# EAGLE design game_kit (EAGLE 5.10)
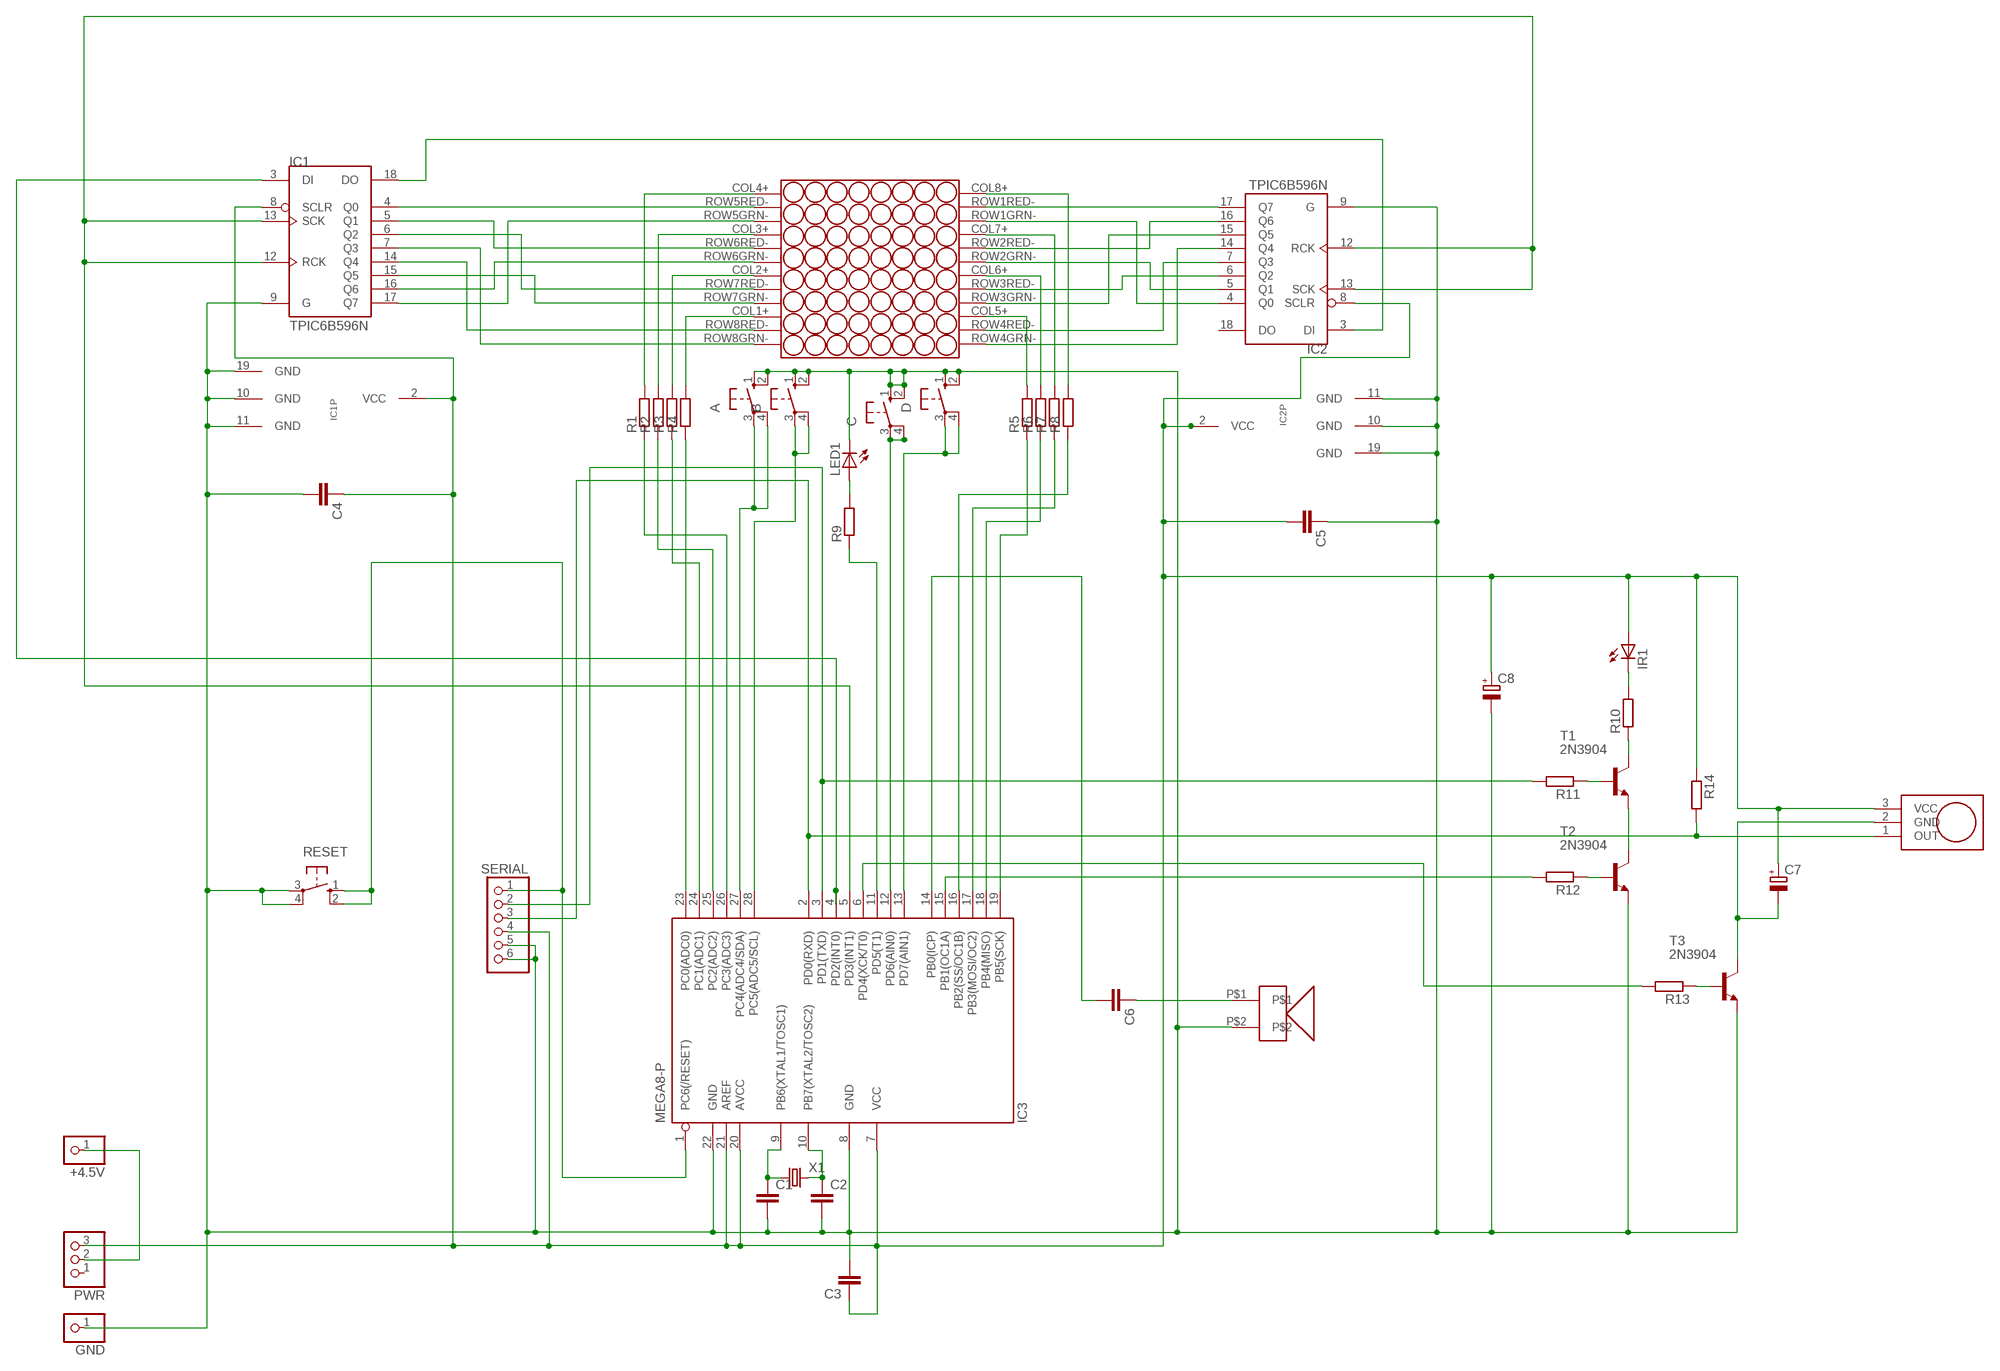
[diagram p0: schematic, sheet 1]

## Parts
+4.5V  PINHD-1X1  [1X01]
A  10-XX  [B3F-10XX]
B  10-XX  [B3F-10XX]
C  10-XX  [B3F-10XX]
C1  C2.5/2  [C2.5-2]
C2  C2.5/2  [C2.5-2]
C3  C2.5/2  [C2.5-2]
C4  C2.5/2  [C2.5-2]
C5  C2.5/2  [C2.5-2]
C6  C2.5/2  [C2.5-2]
C7  CPOL-EUE2.5-5  [E2,5-5]
C8  CPOL-EUE2.5-5  [E2,5-5]
D  10-XX  [B3F-10XX]
GND  PINHD-1X1  [1X01]
IC1  TPIC6B596N  [DIL20]
IC2  TPIC6B596N  [DIL20]
IC3  MEGA8-P  [DIL28-3]
IR1  LED5MM  [LED5MM]
LED1  LED3MM  [LED3MM]
PWR  PINHD-1X3  [1X03]
R1  R-EU_0207/10  [0207/10]
R2  R-EU_0207/10  [0207/10]
R3  R-EU_0207/10  [0207/10]
R4  R-EU_0207/10  [0207/10]
R5  R-EU_0207/10  [0207/10]
R6  R-EU_0207/10  [0207/10]
R7  R-EU_0207/10  [0207/10]
R8  R-EU_0207/10  [0207/10]
R9  R-EU_0207/10  [0207/10]
R10  R-EU_0207/2V  [0207/2V]
R11  R-EU_0207/2V  [0207/2V]
R12  R-EU_0207/2V  [0207/2V]
R13  R-EU_0207/2V  [0207/2V]
R14  R-EU_0207/10  [0207/10]
RESET  10-XX  [B3F-10XX]
SERIAL  PINHD-1X6  [1X06]
T1  2N3904  [TO92]
T2  2N3904  [TO92]
T3  2N3904  [TO92]
U$1  8X8  [SURE8X8]
U$2  THRUHOLEBEEPER  [THRUHOLEBEEPER]
U$3  TSOP4838  [TSOP4838]
X1  CRYSTALHC49U-V  [HC49U-V]

## Nets
GND: A.1(S) A.2(S1) B.1(S) B.2(S1) C1.2 C2.2 C3.2 C4.2 C5.1 C8.- C.1(S) C.2(S1) D.1(S) D.2(S1) GND.1 IC1.9(G) IC1.10(GND) IC1.11(GND) IC1.19(GND) IC2.9(G) IC2.10(GND) IC2.11(GND) IC2.19(GND) IC3.8(GND) IC3.22(GND) LED1.K(C) RESET.3(P) RESET.4(P1) SERIAL.5 SERIAL.6 T2.3(E) T3.3(E) U$2.P$2
N$1: IC1.4(Q0) U$1.ROW5RED-(RED5_CA)
N$2: IC1.17(Q7) U$1.ROW5GRN-(GRN5_CA)
N$3: IC1.5(Q1) U$1.ROW6RED-(RED6_CA)
N$4: IC1.16(Q6) U$1.ROW6GRN-(GRN6_CA)
N$5: IC1.6(Q2) U$1.ROW7RED-(RED7_CA)
N$6: IC1.15(Q5) U$1.ROW7GRN-(GRN7_CA)
N$7: IC1.7(Q3) U$1.ROW8GRN-(GRN8_CA)
N$8: IC1.14(Q4) U$1.ROW8RED-(RED8_CA)
N$9: IC2.17(Q7) U$1.ROW1RED-(RED1_CA)
N$10: IC2.4(Q0) U$1.ROW1GRN-(GRN1_CA)
N$11: IC2.16(Q6) U$1.ROW2RED-(RED2_CA)
N$12: IC2.5(Q1) U$1.ROW2GRN-(GRN2_CA)
N$13: IC2.6(Q2) U$1.ROW3RED-(RED3_CA)
N$14: IC2.15(Q5) U$1.ROW3GRN-(GRN3_CA)
N$15: IC2.7(Q3) U$1.ROW4RED-(RED4_CA)
N$16: IC2.14(Q4) U$1.ROW4GRN-(GRN4_CA)
N$17: R1.2 U$1.COL4+(COL4_AN)
N$18: R2.2 U$1.COL3+(COL3_AN)
N$19: R3.2 U$1.COL2+(COL2_AN)
N$20: R4.2 U$1.COL1+(COL1_AN)
N$21: R5.2 U$1.COL5+(COL5_AN)
N$22: R6.2 U$1.COL6+(COL6_AN)
N$23: R7.2 U$1.COL7+(COL7_AN)
N$24: R8.2 U$1.COL8+(COL8_AN)
N$25: IC3.23(PC0(ADC0)) R4.1
N$26: IC3.24(PC1(ADC1)) R3.1
N$27: IC3.25(PC2(ADC2)) R2.1
N$28: IC3.26(PC3(ADC3)) R1.1
N$29: IC3.16(PB2(SS/OC1B)) R8.1
N$30: IC3.18(PB4(MISO)) R6.1
N$31: IC3.19(PB5(SCK)) R5.1
N$32: +4.5V.1 PWR.2
N$33: C2.1 IC3.10(PB7(XTAL2/TOSC2)) X1.2
N$34: C1.1 IC3.9(PB6(XTAL1/TOSC1)) X1.1
N$35: IC3.3(PD1(TXD)) R11.2 SERIAL.2
N$36: IC3.1(PC6(/RESET)) RESET.1(S) RESET.2(S1) SERIAL.1
N$37: IR1.K(C) R10.2
N$38: IC3.2(PD0(RXD)) R14.2 SERIAL.3 U$3.1(OUT)
N$39: R10.1 T1.1(C)
N$40: C6.1 U$2.P$1
N$41: C6.2 IC3.14(PB0(ICP))
N$42: A.3(P) A.4(P1) IC3.27(PC4(ADC4/SDA))
N$43: B.3(P) B.4(P1) IC3.28(PC5(ADC5/SCL))
N$44: LED1.A R9.2
N$45: C.3(P) C.4(P1) IC3.12(PD6(AIN0))
N$46: D.3(P) D.4(P1) IC3.13(PD7(AIN1))
N$47: IC3.17(PB3(MOSI/OC2)) R7.1
N$48: IC3.11(PD5(T1)) R9.1
N$49: T1.3(E) T2.1(C)
N$50: R11.1 T1.2(B)
N$51: R12.1 T2.2(B)
N$52: IC1.12(RCK) IC1.13(SCK) IC2.12(RCK) IC2.13(SCK) IC3.5(PD3(INT1))
N$53: IC1.18(DO) IC2.3(DI)
N$54: IC1.3(DI) IC3.4(PD2(INT0))
N$55: IC3.15(PB1(OC1A)) R12.2
N$56: R13.1 T3.2(B)
N$57: C7.- T3.1(C) U$3.2(GND)
N$58: IC3.6(PD4(XCK/T0)) R13.2
VCC: C3.1 C4.1 C5.2 C7.+ C8.+ IC1.2(VCC) IC1.8(SCLR) IC2.2(VCC) IC2.8(SCLR) IC3.7(VCC) IC3.20(AVCC) IC3.21(AREF) IR1.A PWR.3 R14.1 SERIAL.4 U$3.3(VCC)
Unconnected: IC2.18(DO) PWR.1

## Library data of the parts
+4.5V GND = pinhead:PINHD-1X1: PIN HEADER
A B C D RESET = switch-omron:10-XX: OMRON SWITCH
C1-C6 = capacitor-wima:C: CAPACITOR naming: grid - package width
C7 C8 = resistor:CPOL-EU: POLARIZED CAPACITOR, European symbol
IC1 IC2 = tpic:TPIC6B596
IC3 = atmel:MEGA8-P: MICROCONTROLLER 8 Kbytes FLASH, 1 kbytes SRAM, 512 bytes EEPROM, USART, 4-channel 10 bit ADC, 2-channel 8 bit ADC Pin compatible with Atmega48, ATMega88, ATMega168 Source: avr.lbr
IR1 LED1 = adafruit:LED: LED OSRAM: - CHIPLED LG R971, LG N971, LY N971, LG Q971, LY Q971, LO R971, LY R971 LH N974, LH R974 LS Q976, LO Q976, LY Q976 LO Q996 - Hyper CHIPLED LW Q18S LB Q993, LB Q99A, LB R99A - SideLED LS A670, LO A670, LY A670, LG A670, LP A670 LB A673, LV A673, LT A673, LW A673 LH A674 LY A675 LS A676, LA A676, LO A676, LY A676, LW A676 LS A679, LY A679, LG A679 - Hyper Micro SIDELED® LS Y876, LA Y876, LO Y876, LY Y876 LT Y87S - SmartLED LW L88C, LW L88S LB L89C, LB L89S, LG L890 LS L89K, LO L89K, LY L89K LS L896, LA L896, LO L896, LY L896 - TOPLED LS T670, LO T670, LY T670, LG T670, LP T670 LSG T670, LSP T670, LSY T670, LOP T670, LYG T670 LG T671, LOG T671, LSG T671 LB T673, LV T673, LT T673, LW T673 LH T674 LS T676, LA T676, LO T676, LY T676, LB T676, LH T676, LSB T676, LW T676 LB T67C, LV T67C, LT T67C, LS T67K, LO T67K, LY T67K, LW E67C LS E67B, LA E67B, LO E67B, LY E67B, LB E67C, LV E67C, LT E67C LW T67C LS T679, LY T679, LG T679 LS T770, LO T770, LY T770, LG T770, LP T770 LB T773, LV T773, LT T773, LW T773 LH T774 LS E675, LA E675, LY E675, LS T675 LS T776, LA T776, LO T776, LY T776, LB T776 LHGB T686 LT T68C, LB T68C - Hyper Mini TOPLED® LB M676 - Mini TOPLED Santana® LG M470 LS M47K, LO M47K, LY M47K Source: http://www.osram.convergy.de/
PWR = pinhead:PINHD-1X3: PIN HEADER
R1-R14 = rcl:R-EU_: RESISTOR, European symbol
SERIAL = pinhead:PINHD-1X6: PIN HEADER
T1-T3 = transistor:2N3904: NPN TRANSISTOR
U$1 = jasons_stuff:8X8: Sure Electronics 8x8 Bi Colour LED matrix
U$2 = jasons_stuff:THRUHOLEBEEPER
U$3 = jasons_stuff:TSOP4838
X1 = crystal:CRYSTAL: CRYSTAL

## Board
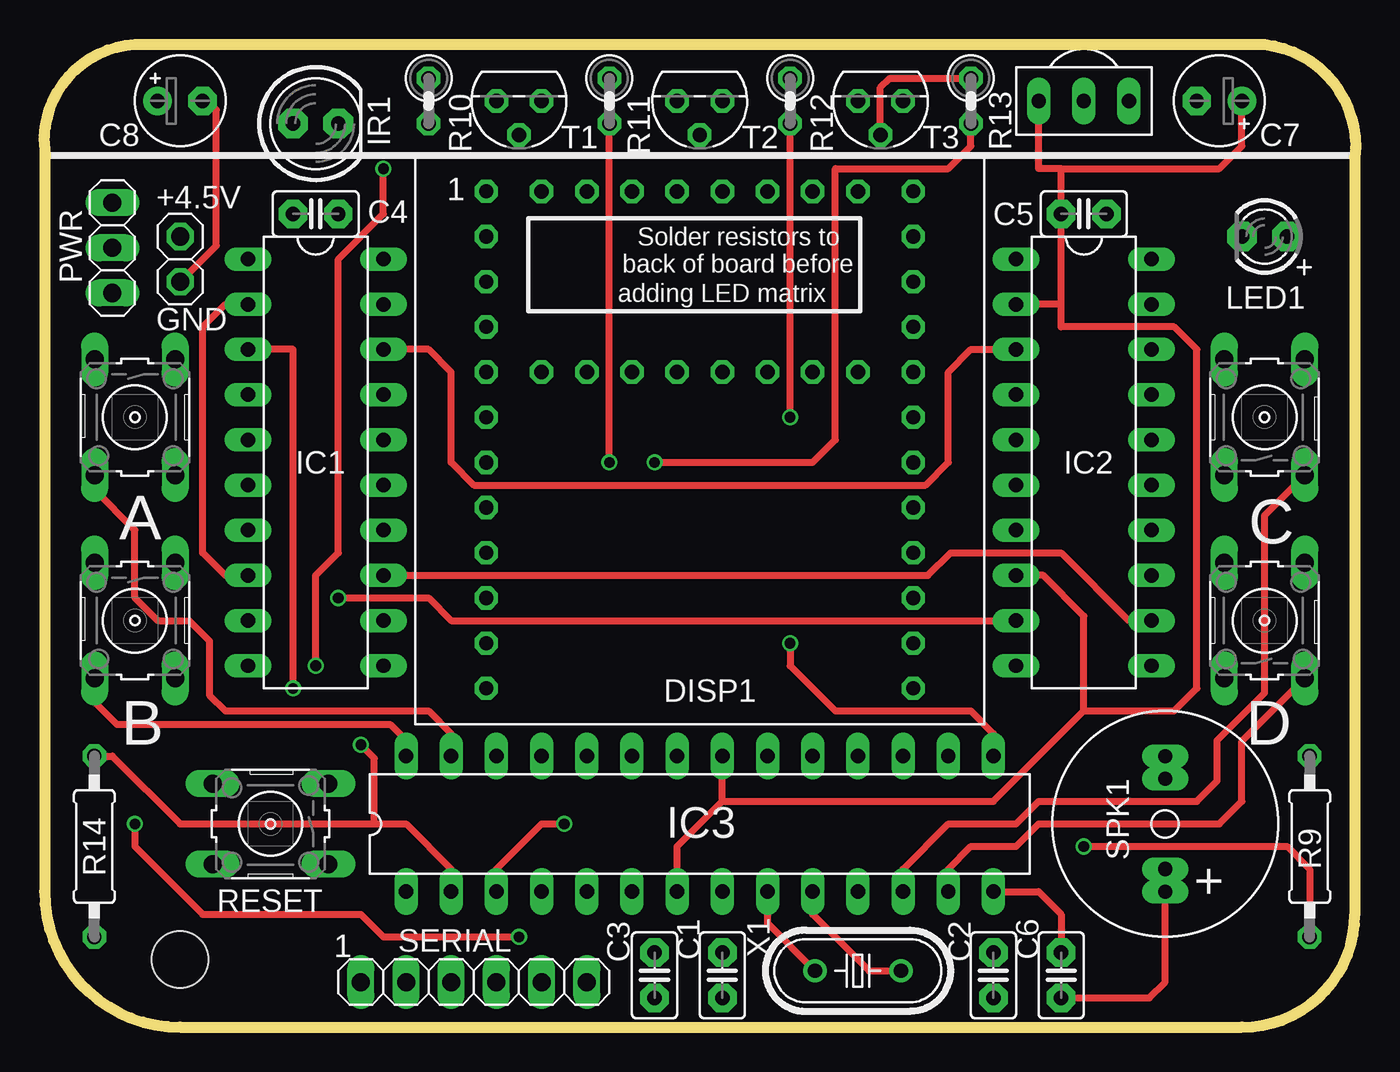
[diagram p1: board, top side]
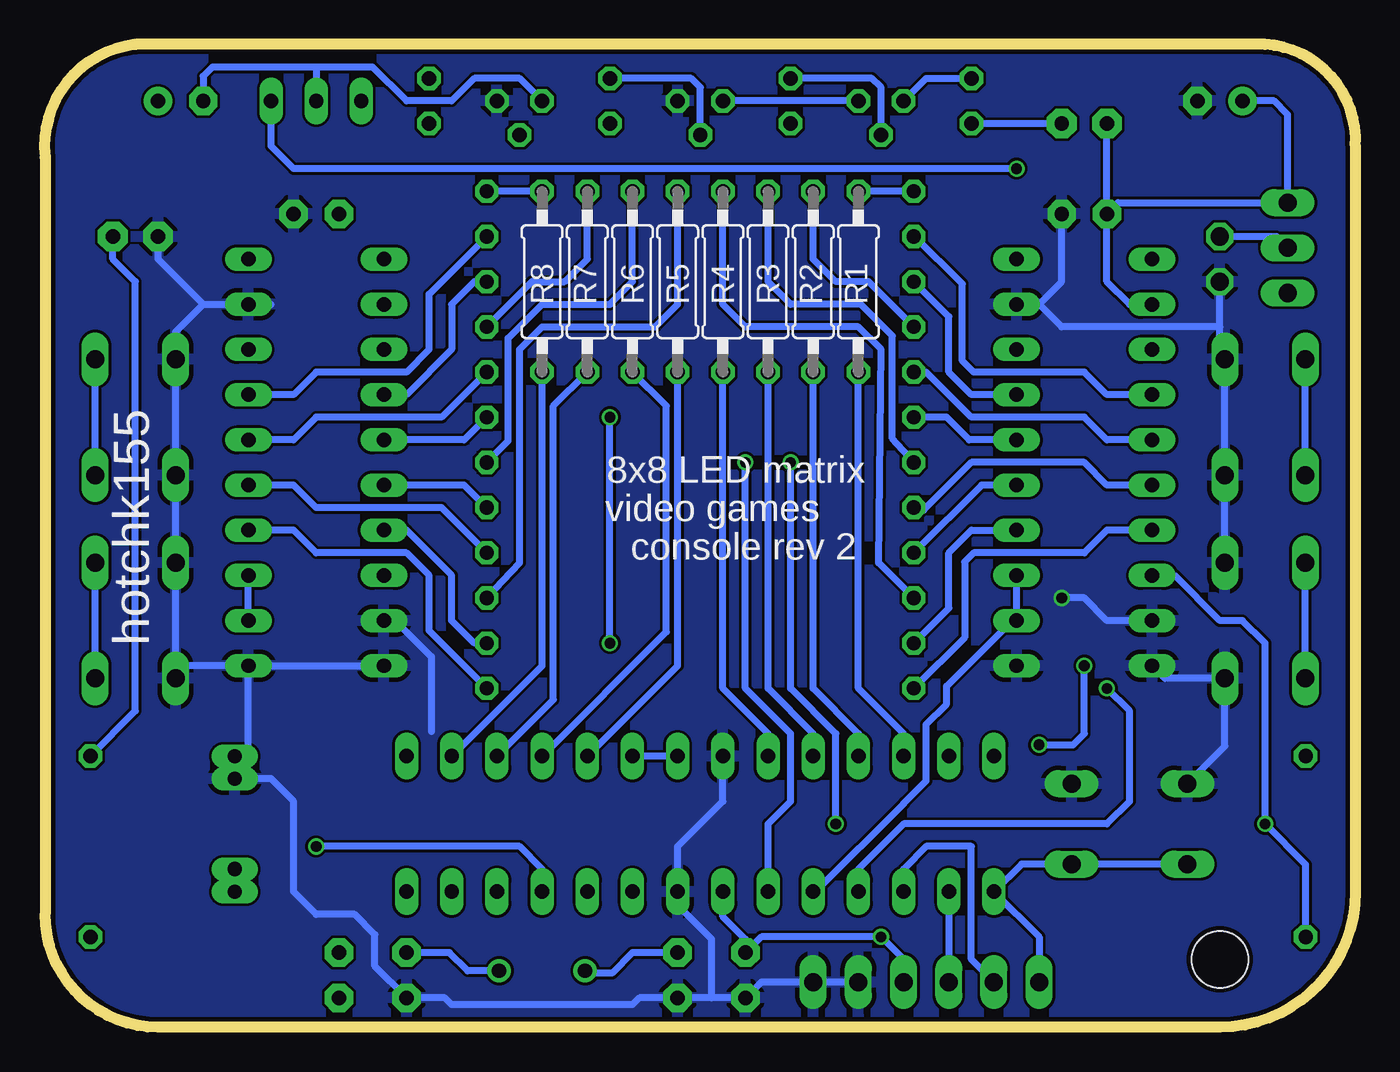
[diagram p2: board, bottom side, seen from below]

Size 73.7 x 55.24 mm. Coordinates in mm from the lower left corner, seen from the top.
Outline: 0.01,49.53 arc-90 5.09,55.24 68.59,55.24 arc-90 73.67,48.9 73.67,6.35 arc-90 67.32,0 7.63,0 arc-90 0.01,7.62 0.01,49.53
Copper layers (1*16): Top 0.035mm / dielectric 1.5mm / Bottom 0.035mm
Design rules "ITEADstudio_DRC": minimum track width 6mil, minimum drill 12mil, track to track 6mil, track to pad 6mil, pad to pad 6mil, via to via 6mil, smd to smd 0mil, copper to edge 10mil, drill to drill 10mil, minimum pad ring 10mil, minimum via ring 6mil, stop-mask expansion 2mil, vias tented up to drill 100mil, thermal gap 10mil
Holes 3.2 mm at 7.63,3.81

### Footprints (pad centres in the part's own frame; a part is rotated, then mirrored left to right if it is on the bottom)
1X01 = drill 1.016 octagon: 1 0,0
B3F-10XX = drill 1.016 long: 1 -3.251,2.261; 2 3.251,2.261; 3 -3.251,-2.261; 4 3.251,-2.261
C2.5-2 = drill 0.813 pad 1.6 octagon: 1 -1.27,0; 2 1.27,0
E2,5-5 = drill 0.813 pad 1.6 round: + -1.27,0 | drill 0.813 pad 1.6 octagon: - 1.27,0
DIL20 = drill 0.813 long: 1 -11.43,-3.81; 2 -8.89,-3.81; 3 -6.35,-3.81; 4 -3.81,-3.81; 5 -1.27,-3.81; 6 1.27,-3.81; 7 3.81,-3.81; 8 6.35,-3.81; 9 8.89,-3.81; 10 11.43,-3.81; 11 11.43,3.81; 12 8.89,3.81; 13 6.35,3.81; 14 3.81,3.81; 15 1.27,3.81; 16 -1.27,3.81; 17 -3.81,3.81; 18 -6.35,3.81; 19 -8.89,3.81; 20 -11.43,3.81
DIL28-3 = drill 0.813 long: 1 -16.51,-3.81; 2 -13.97,-3.81; 3 -11.43,-3.81; 4 -8.89,-3.81; 5 -6.35,-3.81; 6 -3.81,-3.81; 7 -1.27,-3.81; 8 1.27,-3.81; 9 3.81,-3.81; 10 6.35,-3.81; 11 8.89,-3.81; 12 11.43,-3.81; 13 13.97,-3.81; 14 16.51,-3.81; 15 16.51,3.81; 16 13.97,3.81; 17 11.43,3.81; 18 8.89,3.81; 19 6.35,3.81; 20 3.81,3.81; 21 1.27,3.81; 22 -1.27,3.81; 23 -3.81,3.81; 24 -6.35,3.81; 25 -8.89,3.81; 26 -11.43,3.81; 27 -13.97,3.81; 28 -16.51,3.81
LED5MM = drill 0.813 pad 1.676 octagon: A -1.27,0; K 1.27,0
LED3MM = drill 0.813 pad 1.676 octagon: A -1.27,0; K 1.27,0
1X03 = drill 1.016 long: 1 -2.54,0; 2 0,0; 3 2.54,0
0207/10 = drill 0.813 octagon: 1 -5.08,0; 2 5.08,0
0207/2V = drill 0.813 octagon: 1 -1.27,0; 2 1.27,0
1X06 = drill 1.016 long: 1 -6.35,0; 2 -3.81,0; 3 -1.27,0; 4 1.27,0; 5 3.81,0; 6 6.35,0
TO92 = drill 0.813 octagon: 1 1.27,0; 2 0,1.905; 3 -1.27,0
SURE8X8 = drill 0.8 octagon: COL1+ -12.002,-7.62; COL2+ -12.002,0; COL3+ -12.002,7.62; COL4+ -12.002,15.24; COL5+ 12.002,-7.62; COL6+ 12.002,0; COL7+ 12.002,7.62; COL8+ 12.002,15.24; ROW1GRN- 12.002,10.16; ROW1RED- 12.002,12.7; ROW2GRN- 12.002,2.54; ROW2RED- 12.002,5.08; ROW3GRN- 12.002,-5.08; ROW3RED- 12.002,-2.54; ROW4GRN- 12.002,-12.7; ROW4RED- 12.002,-10.16; ROW5GRN- -12.002,10.16; ROW5RED- -12.002,12.7; ROW6GRN- -12.002,2.54; ROW6RED- -12.002,5.08; ROW7GRN- -12.002,-5.08; ROW7RED- -12.002,-2.54; ROW8GRN- -12.002,-12.7; ROW8RED- -12.002,-10.16
THRUHOLEBEEPER = drill 0.8 long: P$1 0,2.54; P$2 0,-2.54; P$3 0,3.81; P$4 0,-3.81
TSOP4838 = drill 0.8 long: 1 -2.54,0; 2 0,0; 3 2.54,0
HC49U-V = drill 0.813 round: 1 -2.413,0; 2 2.413,0

### Placement (x,y rotation side)
+4.5V  7.63,44.45 0 top
A  5.09,34.29 270 top
B  5.09,22.86 270 top
C  68.59,34.29 90 top
C1  38.11,2.92 270 top
C2  53.35,2.92 270 top
C3  34.3,2.92 270 top
C4  15.25,45.72 0 top
C5  58.43,45.72 180 top
C6  57.16,2.92 90 top
C7  66.05,52.07 180 top
C8  7.63,52.07 0 top
D  68.59,22.86 90 top
GND  7.63,41.91 0 top
IC1  15.25,31.75 270 top
IC2  58.43,31.75 270 top
IC3  36.84,11.43 0 top
IR1  15.25,50.8 0 top
LED1  68.59,44.45 180 top
PWR  3.82,43.81 90 top
R1  27.95,41.91 90 bottom
R2  30.49,41.91 90 bottom
R3  33.03,41.91 90 bottom
R4  35.57,41.91 90 bottom
R5  38.11,41.91 90 bottom
R6  40.65,41.91 90 bottom
R7  43.19,41.91 90 bottom
R8  45.73,41.91 90 bottom
R9  71.13,10.16 90 top
R10  21.6,52.07 270 top
R11  31.76,52.07 270 top
R12  41.92,52.07 270 top
R13  52.08,52.07 270 top
R14  2.8,10.16 90 top
RESET  12.71,11.43 180 top
SERIAL  24.14,2.54 0 top
T1  26.68,52.07 180 top
T2  36.84,52.07 180 top
T3  47,52.07 180 top
U$1  36.84,31.75 0 top
U$2  63,11.43 180 top
U$3  58.43,52.07 180 top
X1  45.73,3.17 0 top

### Tracks (layer width: path | path; a pad name or v marks a point on that pad's centre or on a via)
GND  (via drill 0.6)
  Top 0.406: SERIAL.5 27.95,3.81 | IC2.9 22.87,22.86 21.6,24.13 v16.52,24.13 | C8.- 9.15,52.07 9.66,51.56 9.66,43.94 GND.1
  Bottom 0.406: 60.97,40.64 IC2.19 64.78,40.64 | C4.2 16.52,41.91 17.79,40.64 | 17.79,40.64 IC1.19 | SERIAL.5 SERIAL.6 33.41,2.54 C3.2 36.2,1.65 | 36.2,1.65 C1.2 40.26,1.65 40.65,1.27 50.81,1.27 51.19,1.65 C2.2 55.12,3.43 55.12,5.21 56.27,6.35 58.43,6.35 59.7,7.62 59.7,12.7 60.97,13.97 U$2.P$2 62.24,14.73 IC2.11 | 36.2,1.65 36.2,4.95 38.11,6.86 IC3.8 38.11,10.16 35.57,12.7 IC3.22 | 7.63,39.37 7.63,37.82 A.1 A.2 B.1 | 7.63,39.37 GND.1 | 17.79,40.64 16.52,39.37 7.63,39.37 | RESET.4 7.35,15.8 B.2 10.72,19.61 IC1.10 | IC2.11 IC2.10 | IC2.11 65.61,20.32 D.1 D.2 C.1 C.2 66.32,39.09 64.78,40.64 | LED1.K 67.32,43.18 64.78,40.64 | IC2.9 53.98,22.86 51.95,20.83 51.95,16.64 | v16.52,24.13 15.25,24.13 13.98,22.86 IC1.9
  pour Bottom: 0.77,28.83 0.51,7.87 arc90 6.86,0.51 7.12,0.13 arc-90 8.13,0.13 67.44,0.13 arc90 73.41,6.1 73.41,44.96 arc90 73.79,46.1 73.67,47.24 arc90 69.47,54.99 4.45,54.99 arc90 0.26,45.47
N$1
  Bottom 0.406: U$1.ROW5RED- 24.77,44.45 22.1,41.78 22.1,37.47 21.47,36.83 15.25,36.83 13.98,35.56 IC1.4
N$2
  Bottom 0.406: IC1.17 21.6,35.56 22.87,36.83 22.87,39.94 U$1.ROW5GRN-
N$3
  Bottom 0.406: IC1.5 13.98,33.02 15.25,34.29 21.6,34.29 24.14,36.83 U$1.ROW6RED-
N$4
  Bottom 0.406: IC1.16 21.72,33.02 22.99,34.29 U$1.ROW6GRN-
N$5
  Bottom 0.406: IC1.6 13.98,30.48 15.25,31.75 21.6,31.75 24.26,29.08 24.71,29.08 U$1.ROW7RED-
N$6
  Bottom 0.406: IC1.15 21.02,30.48 U$1.ROW7GRN-
N$7
  Bottom 0.406: IC1.7 13.98,27.94 15.25,26.67 21.47,26.67 21.98,26.16 21.98,21.91 U$1.ROW8GRN-
N$8
  Bottom 0.406: IC1.14 21.6,27.94 22.87,26.67 22.87,23.56 U$1.ROW8RED-
N$9
  Bottom 0.406: IC2.17 59.7,35.56 58.43,36.83 53.35,36.83 52.08,38.1 52.08,41.21 U$1.ROW1RED-
N$10
  Bottom 0.406: U$1.ROW1GRN- 49.54,41.91 50.81,40.64 50.81,38.1 53.35,35.56 IC2.4
N$11
  Bottom 0.406: IC2.16 59.7,33.02 58.43,34.29 51.38,34.29 U$1.ROW2RED-
N$12
  Bottom 0.406: IC2.5 50.11,33.02 U$1.ROW2GRN-
N$13
  Bottom 0.406: IC2.6 50.11,30.48 U$1.ROW3RED-
N$14
  Bottom 0.406: IC2.15 59.7,30.48 58.43,29.21 51.38,29.21 U$1.ROW3GRN-
N$15
  Bottom 0.406: U$1.ROW4RED- 49.54,21.59 50.81,22.86 50.81,25.4 53.35,27.94 IC2.7
N$16
  Bottom 0.406: IC2.14 59.7,27.94 58.43,26.67 53.35,26.67 52.08,25.4 52.08,22.29 U$1.ROW4GRN-
N$17
  Bottom 0.406: U$1.COL4+ R1.2
N$18
  Bottom 0.406: R2.2 30.49,43.18 29.22,41.91 27.37,41.91 U$1.COL3+
N$19
  Bottom 0.406: U$1.COL2+ 26.04,33.08 26.04,38.86 27.82,40.64 31.76,40.64 33.03,41.91 R3.2
N$20
  Bottom 0.406: U$1.COL1+ 26.8,26.1 26.68,38.1 27.95,39.37 34.3,39.37 35.57,40.64 R4.2
N$21
  Bottom 0.406: U$1.COL5+ 47,26.1 47,38.1 45.73,39.37 39.38,39.37 38.11,40.64 R5.2
N$22
  Bottom 0.406: U$1.COL6+ 47.63,32.96 47.63,38.73 45.73,40.64 41.92,40.64 40.65,41.91 R6.2
N$23
  Bottom 0.406: R7.2 43.19,43.18 44.46,41.91 46.3,41.91 U$1.COL7+
N$24
  Bottom 0.406: R8.2 U$1.COL8+
N$25
  Bottom 0.406: R4.1 35.57,19.05 33.03,16.51 IC3.23
N$26
  Bottom 0.406: R3.1 33.03,19.05 30.49,16.51 IC3.24
N$27
  Bottom 0.406: R2.1 30.49,19.05 27.95,16.51 IC3.25
N$28
  Bottom 0.406: IC3.26 25.41,16.51 27.95,19.05 R1.1
N$29
  Bottom 0.406: R8.1 45.73,20.32 IC3.16
N$30
  Bottom 0.406: R6.1 38.74,34.93 38.74,22.23 IC3.18
N$31
  Bottom 0.406: IC3.19 38.11,20.32 R5.1
N$32
  Bottom 0.406: +4.5V.1 4.45,44.45 PWR.2
N$33
  Top 0.406: IC3.10 43.19,6.35 46.36,3.17 X1.2
  Bottom 0.406: X1.2 49.92,3.17 50.93,4.19 C2.1
N$34
  Top 0.406: IC3.9 40.65,5.84 X1.1
  Bottom 0.406: C1.1 40.65,4.19 41.79,3.05 43.19,3.05 X1.1
N$35  (via drill 0.6)
  Top 0.406: v31.76,31.75 R11.2 | v29.22,11.43 27.95,11.43 25.41,8.89 IC3.3
  Bottom 0.406: IC3.3 25.41,8.89 24.14,10.16 21.6,10.16 21.6,3.81 SERIAL.2 | v31.76,31.75 31.76,19.05 29.22,16.51 v29.22,11.43
N$36
  Bottom 0.406: SERIAL.1 17.79,5.08 IC3.1 18.78,9.17 RESET.1 RESET.2
N$37
  Bottom 0.406: IR1.K R10.2
N$38  (via drill 0.6)
  Top 0.406: R14.2 3.82,15.24 7.63,11.43 18.42,11.43 | 18.42,11.43 20.33,11.43 22.87,8.89 IC3.2 | v19.06,48.26 19.06,45.72 16.52,43.18 16.52,26.67 15.25,25.4 v15.25,20.32 | v17.79,15.88 18.55,15.11 18.55,11.56 18.42,11.43
  Bottom 0.406: IC3.2 SERIAL.3 | v15.25,20.32 15.25,16.51 15.88,15.88 v17.79,15.88 | v19.06,48.26 59.7,48.26 60.97,49.53 U$3.1
N$39
  Bottom 0.406: R10.1 24.14,53.34 T1.1
N$40
  Top 0.406: C6.1 62.11,1.65 63,2.54 U$2.P$1
N$41
  Top 0.406: IC3.14 55.89,7.62 57.16,6.35 C6.2
N$42
  Top 0.406: A.4 2.82,30.2 5.09,27.94 5.09,24.13 6.36,22.86 8.13,22.86 9.28,21.72 9.28,18.67 10.17,17.78 21.6,17.78 22.87,16.51 IC3.27
  Bottom 0.406: A.4 A.3
N$43
  Top 0.406: B.4 2.82,18.26 4.07,17.02 19.44,17.02 20.33,16.13 IC3.28
  Bottom 0.406: B.4 B.3
N$44
  Bottom 0.406: LED1.A 69.86,43.18 68.59,41.91 68.59,17.78 R9.2
N$45
  Top 0.406: IC3.12 48.27,8.89 50.81,11.43 54.62,11.43 55.89,12.7 64.78,12.7 65.92,13.84 65.92,16.13 68.59,18.8 68.59,28.78 C.3
  Bottom 0.406: C.3 C.4
N$46
  Top 0.406: IC3.13 50.81,8.89 52.08,10.16 54.62,10.16 55.89,11.43 66.05,11.43 67.32,12.7 67.32,16.08 D.3
  Bottom 0.406: D.3 D.4
N$47
  Bottom 0.406: IC3.17 45.09,18.41 45.09,34.93 R7.1
N$48  (via drill 0.6)
  Top 0.406: v58.43,10.16 69.86,10.16 71.13,8.89 R9.1
  Bottom 0.406: IC3.11 45.73,8.89 47,10.16 v58.43,10.16
N$49
  Bottom 0.406: T1.3 T2.1
N$50
  Bottom 0.406: R11.1 27.18,53.34 26.68,52.83 T1.2
N$51
  Bottom 0.406: T2.2 36.84,52.83 37.34,53.34 R12.1
N$52
  Top 0.406: IC2.12 60.97,22.86 57.16,26.67 50.93,26.67 49.66,25.4 IC1.13
  Bottom 0.406: IC2.12 IC2.13 | IC1.13 IC1.12 19.31,22.86 22.99,19.18 22.99,18.16 24.14,17.02 24.14,13.84 25.34,12.64 25.41,12.57 30.36,7.62 IC3.5
N$53
  Top 0.406: IC1.18 21.6,38.1 22.87,36.83 22.87,31.75 24.14,30.48 49.54,30.48 50.81,31.75 50.81,36.83 52.08,38.1 IC2.3
N$54  (via drill 0.6)
  Top 0.406: v13.98,19.05 13.98,38.1 IC1.3
  Bottom 0.406: IC3.4 27.95,8.89 25.41,11.43 13.98,11.43 12.71,12.7 12.71,17.78 v13.98,19.05
N$55  (via drill 0.6)
  Top 0.406: v41.92,34.29 R12.2 | v41.92,21.59 41.92,20.32 44.46,17.78 52.08,17.78 53.35,16.51 IC3.15
  Bottom 0.406: v41.92,21.59 v41.92,34.29
N$56
  Top 0.406: R13.1 47.5,53.34 47,52.83 T3.2
N$57
  Bottom 0.406: T3.1 47,53.34 49.54,53.34 50.81,52.07 53.35,52.07 55.25,53.98 58.43,53.98 | C7.- 64.78,53.47 64.27,53.98 58.43,53.98 | 58.43,53.98 U$3.2
N$58  (via drill 0.6)
  Top 0.406: v34.3,31.75 43.19,31.75 44.46,33.02 44.46,48.26 50.81,48.26 52.08,49.53 R13.2
  Bottom 0.406: v34.3,31.75 34.3,19.05 31.76,16.51 31.76,12.7 33.03,11.43 IC3.6
VCC  (via drill 0.6)
  Top 0.406: 38.11,12.7 IC3.21 | 38.11,12.7 35.57,10.16 IC3.7 | IC2.8 56.14,25.4 58.43,23.11 58.43,17.78 | 38.11,12.7 53.35,12.7 58.43,17.78 | 58.43,17.78 63.51,17.78 64.78,19.05 64.78,38.1 63.51,39.37 57.16,39.37 57.16,40.64 | IC1.2 10.17,40.64 8.9,39.37 8.9,26.67 10.17,25.4 IC1.8 | v26.68,5.08 19.06,5.08 17.79,6.35 8.9,6.35 5.09,10.16 v5.09,11.43 | U$3.3 55.89,48.26 57.16,48.26 | 57.16,48.26 66.05,48.26 67.32,49.53 C7.+ | 57.16,48.26 C5.2 57.16,40.64 | 57.16,40.64 IC2.2
  Bottom 0.406: IC1.2 12.71,40.64 13.98,41.91 C4.1 | IC3.7 35.57,6.22 34.3,4.95 C3.1 33.41,5.08 v26.68,5.08 25.41,3.81 SERIAL.4 | IC3.21 IC3.20 | IC1.8 10.17,25.4 7.63,22.86 6.36,22.86 5.09,21.59 v5.09,11.43 2.8,9.14 R14.1 | C8.+ 4.58,52.07 3.82,51.31 PWR.3 13.34,46.36 C4.1 | C4.1 IR1.A

### Text on the board
tNames: 1 | Solder resistors to | back of board before | adding LED matrix | DISP1 | SPK1 | + | 1
bNames: 8x8 LED matrix | video games | console rev 2 | hotchk155